# Altium schematic sheet Ux.SchDoc
size A4; SheetNumber: 4; SheetTotal: 4
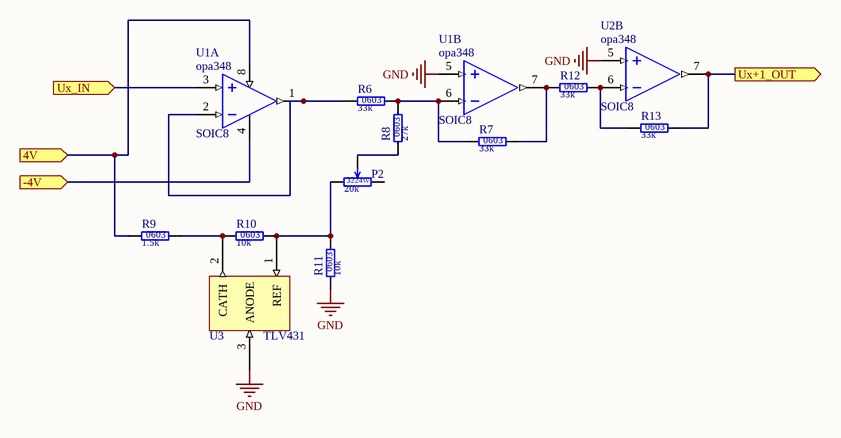
[diagram p0: Ux.SchDoc]

## Parts
P2  value 20k  SCH_Footprint: 3224W  [Potentiometer]  (hidden comment: POT)
R6  SCH_Footprint: 0603  Resistance: 33k  (hidden comment: R)
R7  SCH_Footprint: 0603  Resistance: 33k  (hidden comment: R)
R8  SCH_Footprint: 0603  Resistance: 27k  (hidden comment: R)
R9  SCH_Footprint: 0603  Resistance: 1.5k  (hidden comment: R)
R10  SCH_Footprint: 0603  Resistance: 10k  (hidden comment: R)
R11  SCH_Footprint: 0603  Resistance: 10k  (hidden comment: R)
R12  SCH_Footprint: 0603  Resistance: 33k  (hidden comment: R)
R13  SCH_Footprint: 0603  Resistance: 33k  (hidden comment: R)
U1  value opa348  SCH_Footprint: SOIC8  (hidden comment: A2_8PIN_TYPICAL)  (parts A,B of 2)
U2  value opa348  SCH_Footprint: SOIC8  (hidden comment: A2_8PIN_TYPICAL)  (part B of 2)
U3  TLV431  [SOT23]

## Ports
4V (in), -4V (in), Ux+1_OUT (out), Ux_IN (in)

## Nets
GND: R11.1 U1.5(IN+2) U2.5(IN+2) U3.3(ANODE)
4V: R9.1 U1.8(VDD) ; port 4V
-4V: U1.4(GND) ; port -4V
Ux+1_OUT: R13.2 U2.7(OUT2) ; port Ux+1_OUT
Ux_IN: U1.3(IN+1) ; port Ux_IN
NetP2_1: P2.1 R10.2 R11.2 U3.1(REF)
NetP2_2: P2.2 R8.1
NetR6_1: R6.1 U1.1(OUT1) U1.2(IN-1)
NetR6_2: R6.2 R7.1 R8.2 U1.6(IN-2)
NetR7_2: R7.2 R12.1 U1.7(OUT2)
NetR9_2: R9.2 R10.1 U3.2(CATH)
NetR12_2: R12.2 R13.1 U2.6(IN-2)

Not connected (* = marked no-connect by the designer): P2 3

## Library data of the parts
R6-R13 = R: Tolerance: Value